# Altium schematic sheet PWM_WIDTH.SchDoc
size A4
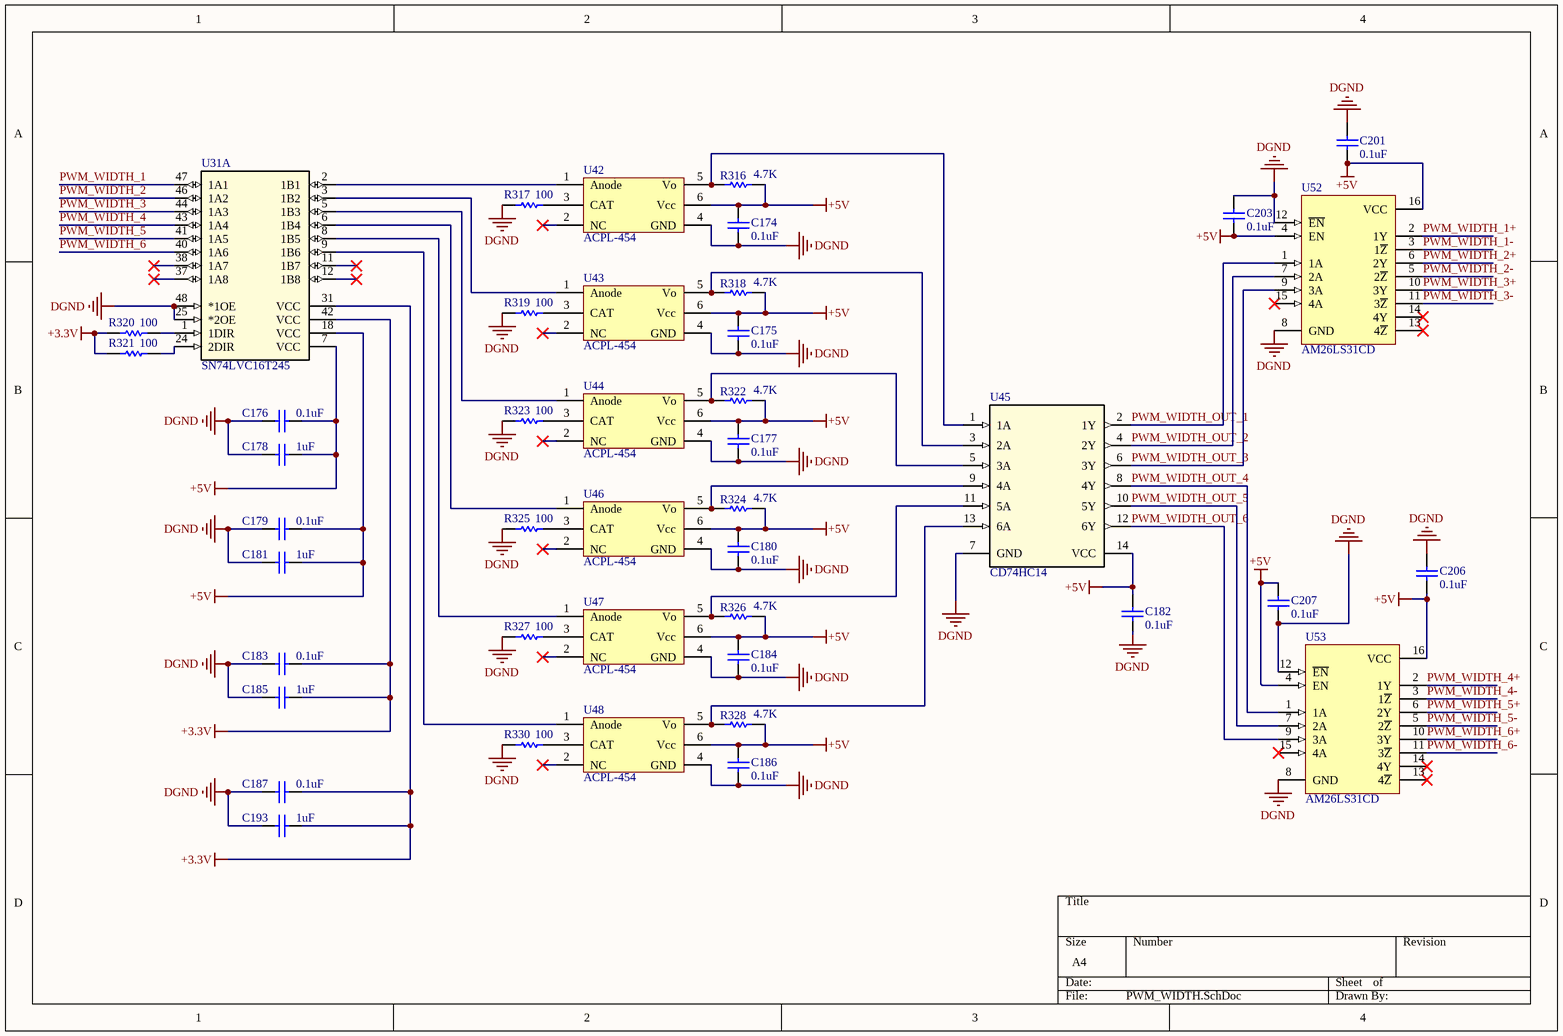
[diagram p0: PWM_WIDTH.SchDoc]

## Parts
C174  value 0.1uF  [1608[0603]]  (hidden comment: Cap)
C175  value 0.1uF  [1608[0603]]  (hidden comment: Cap)
C176  value 0.1uF  [1608[0603]]  (hidden comment: Cap)
C177  value 0.1uF  [1608[0603]]  (hidden comment: Cap)
C178  value 1uF  [1608[0603]]  (hidden comment: Cap)
C179  value 0.1uF  [1608[0603]]  (hidden comment: Cap)
C180  value 0.1uF  [1608[0603]]  (hidden comment: Cap)
C181  value 1uF  [1608[0603]]  (hidden comment: Cap)
C182  value 0.1uF  [1608[0603]]  (hidden comment: Cap)
C183  value 0.1uF  [1608[0603]]  (hidden comment: Cap)
C184  value 0.1uF  [1608[0603]]  (hidden comment: Cap)
C185  value 1uF  [1608[0603]]  (hidden comment: Cap)
C186  value 0.1uF  [1608[0603]]  (hidden comment: Cap)
C187  value 0.1uF  [1608[0603]]  (hidden comment: Cap)
C193  value 1uF  [1608[0603]]  (hidden comment: Cap)
C201  value 0.1uF  [1608[0603]]  (hidden comment: Cap)
C203  value 0.1uF  [1608[0603]]  (hidden comment: Cap)
C206  value 0.1uF  [1608[0603]]  (hidden comment: Cap)
C207  value 0.1uF  [1608[0603]]  (hidden comment: Cap)
R316  value 4.7K  [1608[0603]]  (hidden comment: Res1)
R317  value 100  [1608[0603]]  (hidden comment: Res1)
R318  value 4.7K  [1608[0603]]  (hidden comment: Res1)
R319  value 100  [1608[0603]]  (hidden comment: Res1)
R320  value 100  [1608[0603]]  (hidden comment: Res1)
R321  value 100  [1608[0603]]  (hidden comment: Res1)
R322  value 4.7K  [1608[0603]]  (hidden comment: Res1)
R323  value 100  [1608[0603]]  (hidden comment: Res1)
R324  value 4.7K  [1608[0603]]  (hidden comment: Res1)
R325  value 100  [1608[0603]]  (hidden comment: Res1)
R326  value 4.7K  [1608[0603]]  (hidden comment: Res1)
R327  value 100  [1608[0603]]  (hidden comment: Res1)
R328  value 4.7K  [1608[0603]]  (hidden comment: Res1)
R330  value 100  [1608[0603]]  (hidden comment: Res1)
U31  SN74LVC16T245  [SN74LVC16T245_TSSOP]  (part A of 2)
U42  ACPL-454  [ACPL-P454]
U43  ACPL-454  [ACPL-P454]
U44  ACPL-454  [ACPL-P454]
U45  CD74HC14  [CD74HC14_SOIC]
U46  ACPL-454  [ACPL-P454]
U47  ACPL-454  [ACPL-P454]
U48  ACPL-454  [ACPL-P454]
U52  AM26LS31CD  [D016_N]
U53  AM26LS31CD  [D016_N]

## Nets
+3.3V: C183.1 C185.1 C187.1 C193.1 R320.2 R321.2 U31.31(VCC) U31.42(VCC)
+5V: C174.2 C175.2 C176.1 C177.2 C178.1 C179.1 C180.2 C181.1 C182.2 C184.2 C186.2 C201.2 C203.1 C206.1 C207.2 R316.1 R318.1 R322.1 R324.1 R326.1 R328.1 U31.7(VCC) U31.18(VCC) U42.6(Vcc) U43.6(Vcc) U44.6(Vcc) U45.14(VCC) U46.6(Vcc) U47.6(Vcc) U48.6(Vcc) U52.4(EN) U52.16(VCC) U53.4(EN) U53.16(VCC)
DGND: C174.1 C175.1 C176.2 C177.1 C178.2 C179.2 C180.1 C181.2 C182.1 C183.2 C184.1 C185.2 C186.1 C187.2 C193.2 C201.1 C203.2 C206.2 C207.1 R317.2 R319.2 R323.2 R325.2 R327.2 R330.2 U31.25(*2OE) U31.48(*1OE) U42.4(GND) U43.4(GND) U44.4(GND) U45.7(GND) U46.4(GND) U47.4(GND) U48.4(GND) U52.8(GND) U52.12(~{EN}) U53.8(GND) U53.12(~{EN})
PWM_WIDTH_1: U31.47(1A1)
PWM_WIDTH_1+: U52.2(1Y)
PWM_WIDTH_1-: U52.3(1~{Z})
PWM_WIDTH_2: U31.46(1A2)
PWM_WIDTH_2+: U52.6(2Y)
PWM_WIDTH_2-: U52.5(2~{Z})
PWM_WIDTH_3: U31.44(1A3)
PWM_WIDTH_3+: U52.10(3Y)
PWM_WIDTH_3-: U52.11(3~{Z})
PWM_WIDTH_4: U31.43(1A4)
PWM_WIDTH_4+: U53.2(1Y)
PWM_WIDTH_4-: U53.3(1~{Z})
PWM_WIDTH_5: U31.41(1A5)
PWM_WIDTH_5+: U53.6(2Y)
PWM_WIDTH_5-: U53.5(2~{Z})
PWM_WIDTH_6: U31.40(1A6)
PWM_WIDTH_6+: U53.10(3Y)
PWM_WIDTH_6-: U53.11(3~{Z})
PWM_WIDTH_OUT_1: U45.2(1Y) U52.1(1A)
PWM_WIDTH_OUT_2: U45.4(2Y) U52.7(2A)
PWM_WIDTH_OUT_3: U45.6(3Y) U52.9(3A)
PWM_WIDTH_OUT_4: U45.8(4Y) U53.1(1A)
PWM_WIDTH_OUT_5: U45.10(5Y) U53.7(2A)
PWM_WIDTH_OUT_6: U45.12(6Y) U53.9(3A)
NetR316_2: R316.2 U42.5(Vo) U45.1(1A)
NetR317_1: R317.1 U42.3(CAT)
NetR318_2: R318.2 U43.5(Vo) U45.3(2A)
NetR319_1: R319.1 U43.3(CAT)
NetR320_1: R320.1 U31.1(1DIR)
NetR321_1: R321.1 U31.24(2DIR)
NetR322_2: R322.2 U44.5(Vo) U45.5(3A)
NetR323_1: R323.1 U44.3(CAT)
NetR324_2: R324.2 U45.9(4A) U46.5(Vo)
NetR325_1: R325.1 U46.3(CAT)
NetR326_2: R326.2 U45.11(5A) U47.5(Vo)
NetR327_1: R327.1 U47.3(CAT)
NetR328_2: R328.2 U45.13(6A) U48.5(Vo)
NetR330_1: R330.1 U48.3(CAT)
NetU31_2: U31.2(1B1) U42.1(Anode)
NetU31_3: U31.3(1B2) U43.1(Anode)
NetU31_5: U31.5(1B3) U44.1(Anode)
NetU31_6: U31.6(1B4) U46.1(Anode)
NetU31_8: U31.8(1B5) U47.1(Anode)
NetU31_9: U31.9(1B6) U48.1(Anode)

Not connected (* = marked no-connect by the designer): U31 11(1B7)* 12(1B8)* 37(1A8)* 38(1A7)*; U42 2(NC)*; U43 2(NC)*; U44 2(NC)*; U46 2(NC)*; U47 2(NC)*; U48 2(NC)*; U52 13(4~{Z})* 14(4Y)* 15(4A)*; U53 13(4~{Z})* 14(4Y)* 15(4A)*

## Library data of the parts
C174-C187 C193 C201 C203 C206 C207 = Cap: Capacitor; Published: 8-Jun-2000; LatestRevisionDate: 17-Jul-2002; LatestRevisionNote: Re-released for DXP Platform.; PackageReference: RAD-0.3; Publisher: Altium Limited; PackageDescription: Radial Cap, Thru-Hole; 2 Leads; 0.3 in Pin Spacing
R316-R328 R330 = Res1: Resistor; Published: 8-Jun-2000; LatestRevisionDate: 17-Jul-2002; LatestRevisionNote: Re-released for DXP Platform.; PackageReference: AXIAL-0.3; Publisher: Altium Limited; PackageDescription: Axial Device, Thru-Hole; 2 Leads; 0.3 in Pin Spacing
U31 = SN74LVC16T245_A
U45 = CD74HC14: Manufacturer: Texas Instruments; INDUSTRY_STD_PKG_TYPE: SOIC; FAMILY_NAME: INVERTING BUFFER/DRIVER; PIN_COUNT: 14; PACKAGE_DESIGNATOR: D; Datasheet_URL: http://www.ti.com/lit/gpn/CD74HC14; GENERIC_PART_NUMBER: CD74HC14; Value: Value; Type: Type; RefDes: RefDes
U52 U53 = AM26LS31CD: Quadruple Differential Line Driver; Published: 15-May-2002; LatestRevisionDate: 13-Apr-2006; LatestRevisionNote: IPC-7351 Footprint Added.; DatasheetVersion: May-1990; PackageVersion: Jan-1998; PackageReference: D016; Publisher: Altium Limited; PackageDescription: 16-Pin Small Outline Integrated Circuit 1.27 mm Pitch; Code_IPC: SOIC127P600-16; ComponentLink1Description: Manufacturer Link; ComponentLink1URL: http://www.ti.com/; ComponentLink2Description: Datasheet; ComponentLink2URL: http://www-s.ti.com/sc/ds/am26ls31.pdf